# Altium project team build full layout.PrjPcb
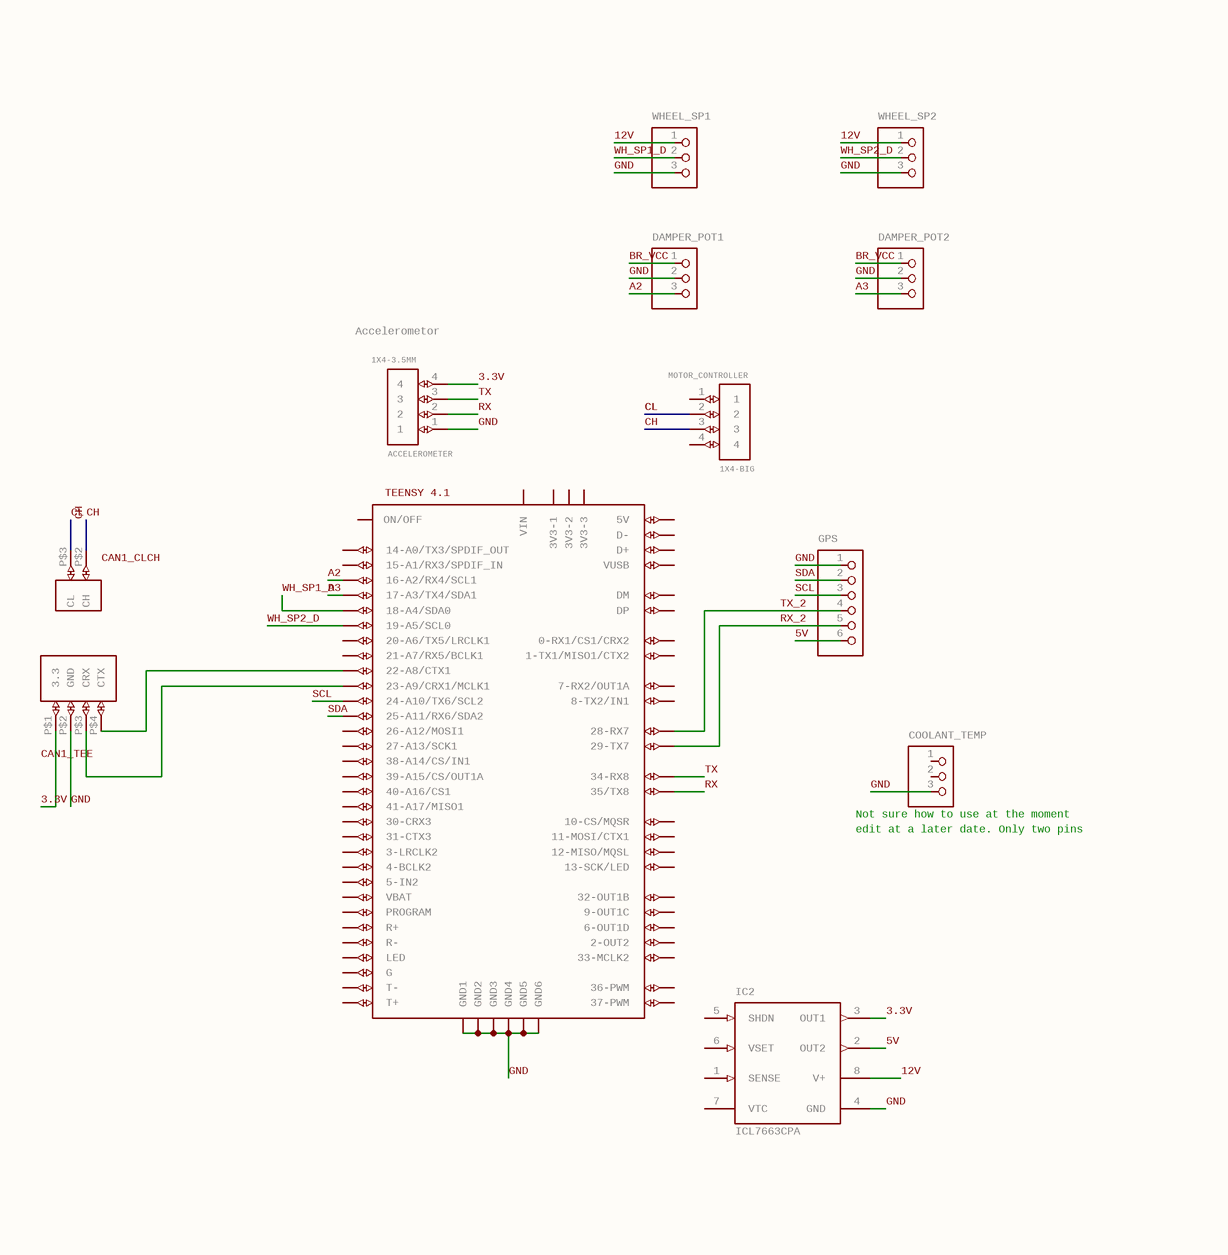
[diagram p0: team build full layout.SchDoc, left]
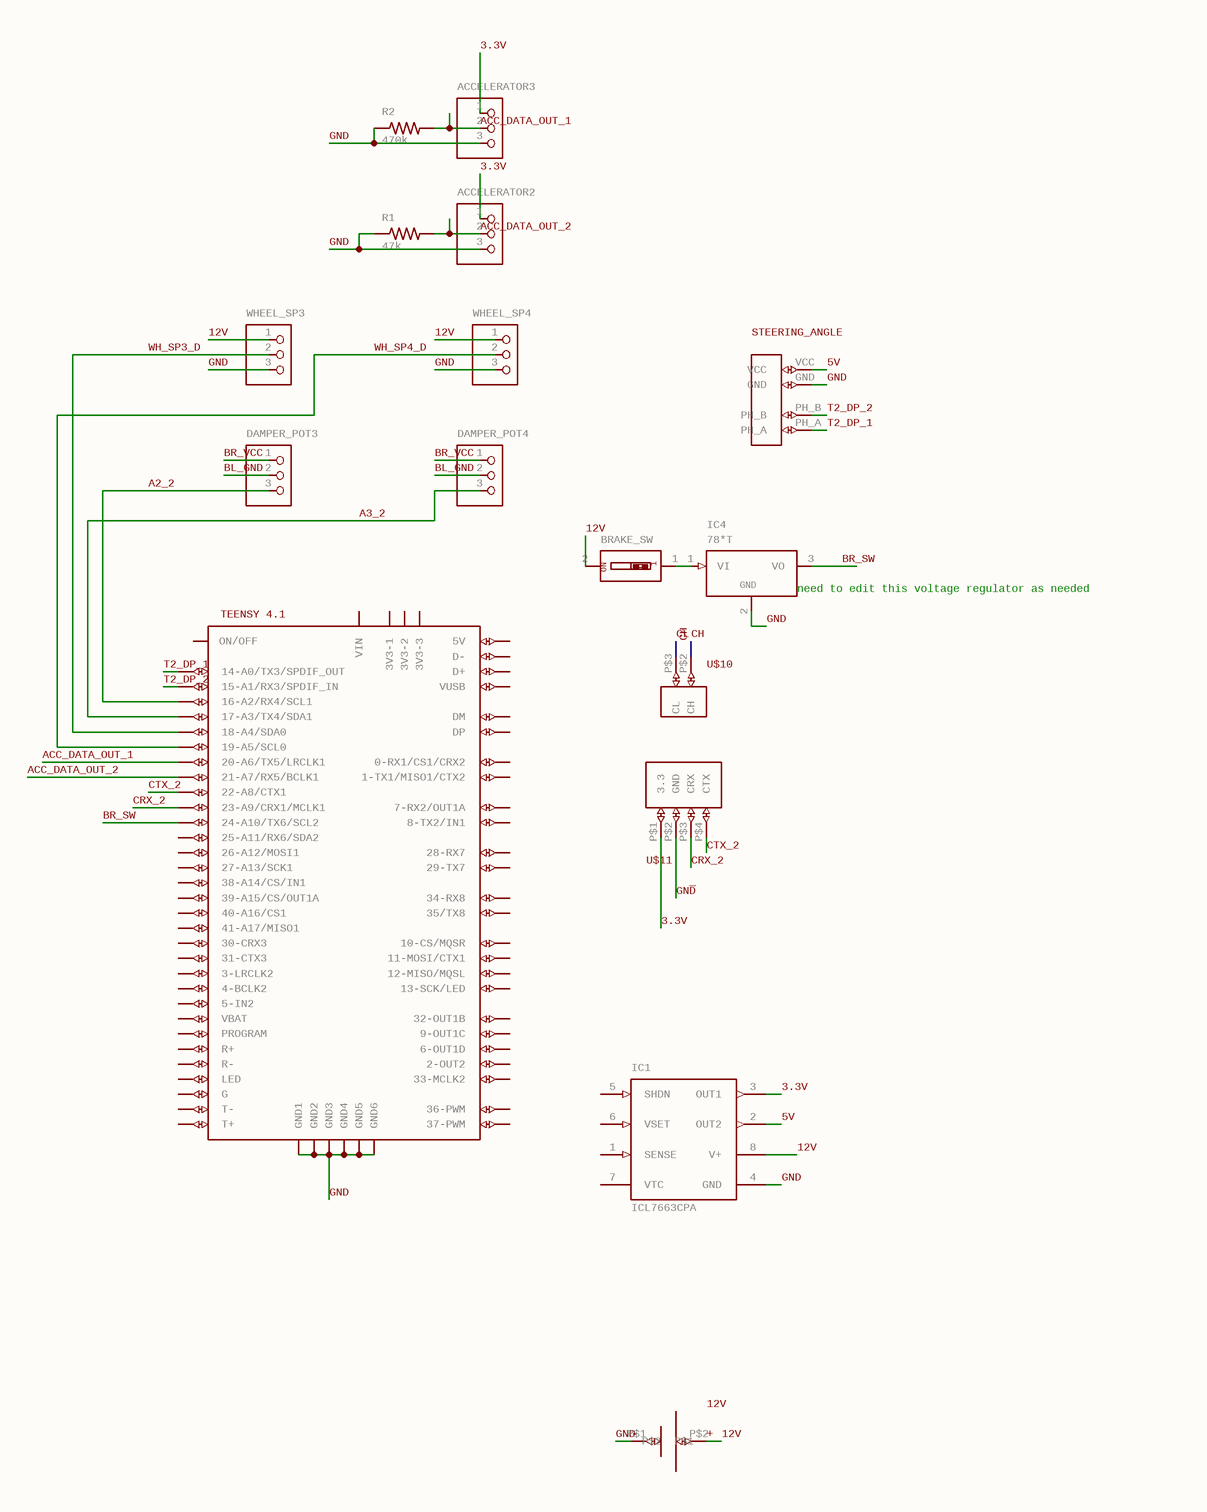
[diagram p1: team build full layout.SchDoc, middle]
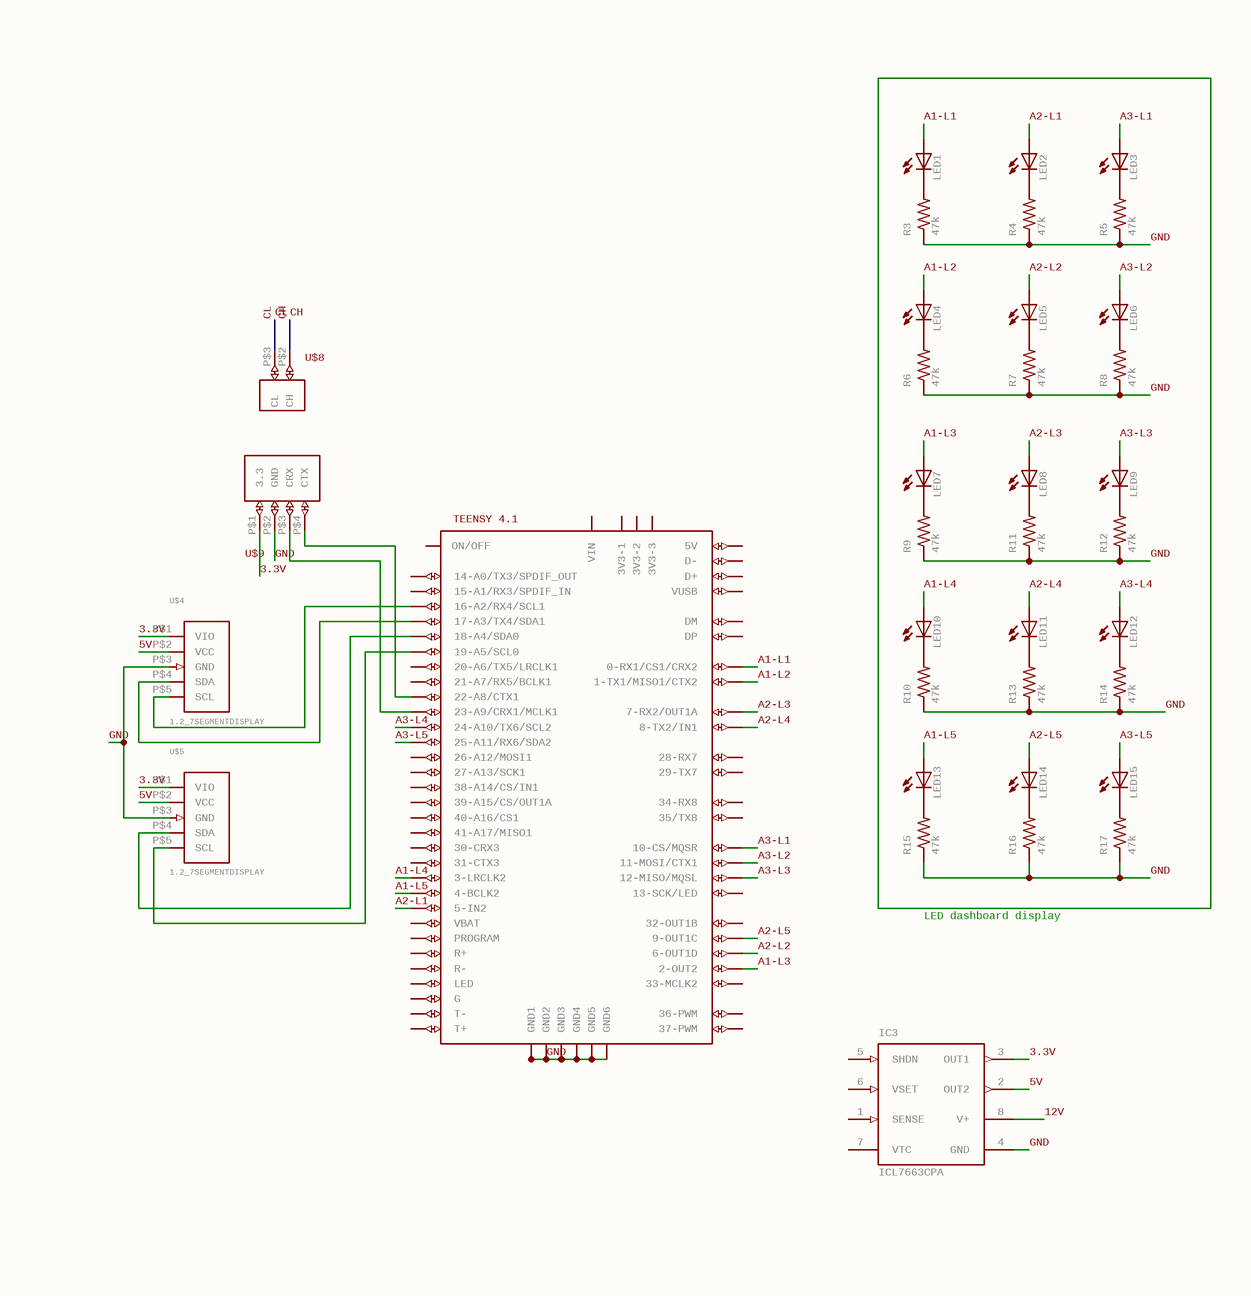
[diagram p2: team build full layout.SchDoc, right]
1 sheet, 64 parts. Net scope: global (net labels, ports and power ports of the same name join across sheets).

## Sheet team build full layout.SchDoc
size 739 x 259 mm; Origin: Eagle

### Parts
12V  PWD_12  [PWD_12]  (value not drawn)
ACCELERATOR2  PINHD-1X3  [1X03]  (value not drawn)
ACCELERATOR3  PINHD-1X3  [1X03]  (value not drawn)
ACCELEROMETER  1X4-3.5MM  AC: Accelerometor  [1X04-3.5MM]
BRAKE_SW  SW_DIP-1  [EDG-01]  (value not drawn)
CAN1_CLCH  CAN_BUS  [CAN_BUS]  (value not drawn)
CAN1_TEE  CAN_TEE  [CAN_TEN]  (value not drawn)
COOLANT_TEMP  PINHD-1X3  [1X03]  (value not drawn)
DAMPER_POT1  PINHD-1X3CB  [1X03-CLEANBIG]  (value not drawn)
DAMPER_POT2  PINHD-1X3CB  [1X03-CLEANBIG]  (value not drawn)
DAMPER_POT3  PINHD-1X3CB  [1X03-CLEANBIG]  (value not drawn)
DAMPER_POT4  PINHD-1X3CB  [1X03-CLEANBIG]  (value not drawn)
GPS  PINHD-1X6-3.5MM  [1X06-3.5MM]  (value not drawn)
IC1  ICL7663CPA  [DIL08]
IC2  ICL7663CPA  [DIL08]
IC3  ICL7663CPA  [DIL08]
IC4  78*T  [TO220H]
LED1  LED3MM  [LED3MM]  (value not drawn)
LED2  LED3MM  [LED3MM]  (value not drawn)
LED3  LED3MM  [LED3MM]  (value not drawn)
LED4  LED3MM  [LED3MM]  (value not drawn)
LED5  LED3MM  [LED3MM]  (value not drawn)
LED6  LED3MM  [LED3MM]  (value not drawn)
LED7  LED3MM  [LED3MM]  (value not drawn)
LED8  LED3MM  [LED3MM]  (value not drawn)
LED9  LED3MM  [LED3MM]  (value not drawn)
LED10  LED3MM  [LED3MM]  (value not drawn)
LED11  LED3MM  [LED3MM]  (value not drawn)
LED12  LED3MM  [LED3MM]  (value not drawn)
LED13  LED3MM  [LED3MM]  (value not drawn)
LED14  LED3MM  [LED3MM]  (value not drawn)
LED15  LED3MM  [LED3MM]  (value not drawn)
MOTOR_CONTROLLER  1X4-BIG  [1X04-BIG]
R1  47k  [0204/7]
R2  470k  [0204/7]
R3  47k  [0204/7]
R4  47k  [0204/7]
R5  47k  [0204/7]
R6  47k  [0204/7]
R7  47k  [0204/7]
R8  47k  [0204/7]
R9  47k  [0204/7]
R10  47k  [0204/7]
R11  47k  [0204/7]
R12  47k  [0204/7]
R13  47k  [0204/7]
R14  47k  [0204/7]
R15  47k  [0204/7]
R16  47k  [0204/7]
R17  47k  [0204/7]
STEERING_ANGLE  ROTARY_ENCODER  [ROTARY_ENCODER]  (value not drawn)
U$1  TEENSY4.1: TEENSY 4.1  [TEENSY41]  (hidden comment: TEENSY41)
U$2  TEENSY4.1: TEENSY 4.1  [TEENSY41]  (hidden comment: TEENSY41)
U$3  TEENSY4.1: TEENSY 4.1  [TEENSY41]  (hidden comment: TEENSY41)
U$4  1.2_7SEGMENTDISPLAY  [5IL]
U$5  1.2_7SEGMENTDISPLAY  [5IL]
U$8  CAN_BUS  [CAN_BUS]  (value not drawn)
U$9  CAN_TEE  [CAN_TEN]  (value not drawn)
U$10  CAN_BUS  [CAN_BUS]  (value not drawn)
U$11  CAN_TEE  [CAN_TEN]  (value not drawn)
WHEEL_SP1  PINHD-1X3  [1X03]  (value not drawn)
WHEEL_SP2  PINHD-1X3  [1X03]  (value not drawn)
WHEEL_SP3  PINHD-1X3  [1X03]  (value not drawn)
WHEEL_SP4  PINHD-1X3  [1X03]  (value not drawn)

### Nets
3.3V: ACCELERATOR2.1 ACCELERATOR3.1 ACCELEROMETER.4 CAN1_TEE.P$1(3.3) IC1.3(OUT1) IC2.3(OUT1) IC3.3(OUT1) U$4.P$1(VIO) U$5.P$1(VIO) U$9.P$1(3.3) U$11.P$1(3.3)
5V: GPS.6 IC1.2(OUT2) IC2.2(OUT2) IC3.2(OUT2) STEERING_ANGLE.VCC U$4.P$2(VCC) U$5.P$2(VCC)
12V: 12V.P$2 BRAKE_SW.2 IC1.8(V+) IC2.8(V+) IC3.8(V+) WHEEL_SP1.1 WHEEL_SP2.1 WHEEL_SP3.1 WHEEL_SP4.1
A1-L1: LED1.A U$2.0-RX1/CS1/CRX2
A1-L2: LED4.A U$2.1-TX1/MISO1/CTX2
A1-L3: LED7.A U$2.2-OUT2
A1-L4: LED10.A U$2.3-LRCLK2
A1-L5: LED13.A U$2.4-BCLK2
A2: DAMPER_POT1.3 U$1.16-A2/RX4/SCL1
A2-L1: LED2.A U$2.5-IN2
A2-L2: LED5.A U$2.6-OUT1D
A2-L3: LED8.A U$2.7-RX2/OUT1A
A2-L4: LED11.A U$2.8-TX2/IN2(8-TX2/IN1)
A2-L5: LED14.A U$2.9-OUT1C
A2_2: DAMPER_POT3.3 U$3.16-A2/RX4/SCL1
A3: DAMPER_POT2.3 U$1.17-A3/TX4/SDA1
A3-L1: LED3.A U$2.10-CS\MQSR(10-CS/MQSR)
A3-L2: LED6.A U$2.11-MOSI/CTX1
A3-L3: LED9.A U$2.12-MISO/MQSL
A3-L4: LED12.A U$2.24-A10/TX6/SCL2
A3-L5: LED15.A U$2.25-A11/RX6/SDA2
A3_2: DAMPER_POT4.3 U$3.17-A3/TX4/SDA1
ACC_DATA_OUT_1: ACCELERATOR3.2 R2.2 U$3.20-A6/TX5/LRCLK1
ACC_DATA_OUT_2: ACCELERATOR2.2 R1.2 U$3.21-A7/RX5/BCLK1
BL_GND: DAMPER_POT3.2 DAMPER_POT4.2
BR_SW: IC4.3(VO) U$3.24-A10/TX6/SCL2
BR_VCC: DAMPER_POT1.1 DAMPER_POT2.1 DAMPER_POT3.1 DAMPER_POT4.1
CRX_2: U$3.23-A9/CRX1/MCLK1 U$11.P$3(CRX)
CTX_2: U$3.22-A8/CTX1 U$11.P$4(CTX)
GND: 12V.P$1 ACCELERATOR2.3 ACCELERATOR3.3 ACCELEROMETER.1 CAN1_TEE.P$2(GND) COOLANT_TEMP.3 DAMPER_POT1.2 DAMPER_POT2.2 GPS.1 IC1.4(GND) IC2.4(GND) IC3.4(GND) IC4.2(GND) R1.1 R2.1 R3.1 R4.1 R5.1 R6.1 R7.1 R8.1 R9.1 R10.1 R11.1 R12.1 R13.1 R14.1 R15.1 R16.1 R17.1 STEERING_ANGLE.GND U$1.GND1 U$1.GND2 U$1.GND3 U$1.GND4 U$1.GND5 U$1.GND6 U$2.GND1 U$2.GND2 U$2.GND3 U$2.GND4 U$2.GND5 U$2.GND6 U$3.GND1 U$3.GND2 U$3.GND3 U$3.GND4 U$3.GND5 U$3.GND6 U$4.P$3(GND) U$5.P$3(GND) U$9.P$2(GND) WHEEL_SP1.3 WHEEL_SP2.3 WHEEL_SP3.3 WHEEL_SP4.3
GN~{D}: U$11.P$2(GND)
RX: ACCELEROMETER.2 U$1.35-TX8(35/TX8)
RX_2: GPS.5 U$1.29-TX7
SCL: GPS.3 U$1.24-A10/TX6/SCL2
SDA: GPS.2 U$1.25-A11/RX6/SDA2
T2_DP_1: STEERING_ANGLE.PH_A U$3.14-A0/TX3/SPDIF_OUT
T2_DP_2: STEERING_ANGLE.PH_B U$3.15-A1/RX3/SPDIF_IN
TX: ACCELEROMETER.3 U$1.34-RX8
TX_2: GPS.4 U$1.28-RX7
WH_SP1_D: U$1.18-A4/SDA0 WHEEL_SP1.2
WH_SP2_D: U$1.19-A5/SCL0 WHEEL_SP2.2
WH_SP3_D: U$3.18-A4/SDA0 WHEEL_SP3.2
WH_SP4_D: U$3.19-A5/SCL0 WHEEL_SP4.2
NetBRAKE_SW_1: BRAKE_SW.1 IC4.1(VI)
NetCAN1_TEE_P$3: CAN1_TEE.P$3(CRX) U$1.23-A9/CRX1/MCLK1
NetCAN1_TEE_P$4: CAN1_TEE.P$4(CTX) U$1.22-A8/CTX1
NetLED1_K: LED1.K(C) R3.2
NetLED2_K: LED2.K(C) R4.2
NetLED3_K: LED3.K(C) R5.2
NetLED4_K: LED4.K(C) R6.2
NetLED5_K: LED5.K(C) R7.2
NetLED6_K: LED6.K(C) R8.2
NetLED7_K: LED7.K(C) R9.2
NetLED8_K: LED8.K(C) R11.2
NetLED9_K: LED9.K(C) R12.2
NetLED10_K: LED10.K(C) R10.2
NetLED11_K: LED11.K(C) R13.2
NetLED12_K: LED12.K(C) R14.2
NetLED13_K: LED13.K(C) R15.2
NetLED14_K: LED14.K(C) R16.2
NetLED15_K: LED15.K(C) R17.2
NetU$2_16-A2/RX4/SCL1: U$2.16-A2/RX4/SCL1 U$4.P$5(SCL)
NetU$2_17-A3/TX4/SDA1: U$2.17-A3/TX4/SDA1 U$4.P$4(SDA)
NetU$2_18-A4/SDA0: U$2.18-A4/SDA0 U$5.P$4(SDA)
NetU$2_19-A5/SCL0: U$2.19-A5/SCL0 U$5.P$5(SCL)
NetU$2_22-A8/CTX1: U$2.22-A8/CTX1 U$9.P$4(CTX)
NetU$2_23-A9/CRX1/MCLK1: U$2.23-A9/CRX1/MCLK1 U$9.P$3(CRX)

Not connected (* = marked no-connect by the designer): CAN1_CLCH P$2(CH) P$3(CL); COOLANT_TEMP 1 2; IC1 1(SENSE) 5(SHDN) 6(VSET) 7(VTC); IC2 1(SENSE) 5(SHDN) 6(VSET) 7(VTC); IC3 1(SENSE) 5(SHDN) 6(VSET) 7(VTC); MOTOR_CONTROLLER 1 2 3 4; U$1 0-RX1/CS1/CRX2 1-TX1/MISO1/CTX2 2-OUT2 3-LRCLK2 3V3-1 3V3-2 3V3-3 4-BCLK2 5-IN2 6-OUT1D 7-RX2/OUT1A 8-TX2/IN2(8-TX2/IN1) 9-OUT1C 10-CS\MQSR(10-CS/MQSR) 11-MOSI/CTX1 12-MISO/MQSL 13-SCK/LED 14-A0/TX3/SPDIF_OUT 15-A1/RX3/SPDIF_IN 20-A6/TX5/LRCLK1 21-A7/RX5/BCLK1 26-A12/MOSI1 27-A13/SCK1 30-CRX3 31-CTX3 32-OUT1B 33-MCLK2 36-PWM 37-PWM 38-A14/CS/IN1 39-A15/CS/OUT1A 40-A16/CS1 41-A17/MISO1 +5V(5V) D+ D- DM DP G LED ON/OFF PROGRAM R+ R- T+ T- VBAT VIN VUSB; U$2 3V3-1 3V3-2 3V3-3 13-SCK/LED 14-A0/TX3/SPDIF_OUT 15-A1/RX3/SPDIF_IN 20-A6/TX5/LRCLK1 21-A7/RX5/BCLK1 26-A12/MOSI1 27-A13/SCK1 28-RX7 29-TX7 30-CRX3 31-CTX3 32-OUT1B 33-MCLK2 34-RX8 35-TX8(35/TX8) 36-PWM 37-PWM 38-A14/CS/IN1 39-A15/CS/OUT1A 40-A16/CS1 41-A17/MISO1 +5V(5V) D+ D- DM DP G LED ON/OFF PROGRAM R+ R- T+ T- VBAT VIN VUSB; U$3 0-RX1/CS1/CRX2 1-TX1/MISO1/CTX2 2-OUT2 3-LRCLK2 3V3-1 3V3-2 3V3-3 4-BCLK2 5-IN2 6-OUT1D 7-RX2/OUT1A 8-TX2/IN2(8-TX2/IN1) 9-OUT1C 10-CS\MQSR(10-CS/MQSR) 11-MOSI/CTX1 12-MISO/MQSL 13-SCK/LED 25-A11/RX6/SDA2 26-A12/MOSI1 27-A13/SCK1 28-RX7 29-TX7 30-CRX3 31-CTX3 32-OUT1B 33-MCLK2 34-RX8 35-TX8(35/TX8) 36-PWM 37-PWM 38-A14/CS/IN1 39-A15/CS/OUT1A 40-A16/CS1 41-A17/MISO1 +5V(5V) D+ D- DM DP G LED ON/OFF PROGRAM R+ R- T+ T- VBAT VIN VUSB; U$8 P$2(CH) P$3(CL); U$10 P$2(CH) P$3(CL)

### Buses and harness runs
bus CH
bus CL

### Notes on the sheet
- (near IC4) need to edit this voltage regulator as needed
- (near COOLANT_TEMP) Not sure how to use at the moment
- (near COOLANT_TEMP) edit at a later date. Only two pins
- LED dashboard display

### Library data of the parts
12V = PWD_12: GateName_1: G$1; SymbolName_1: PWD_12; LibraryName: F-E library custom components; DeviceSetName: PWD_12; +: +; -: -
ACCELERATOR2 ACCELERATOR3 COOLANT_TEMP WHEEL_SP1-WHEEL_SP4 = PINHD-1X3: PIN HEADER; GateName_1: A; SymbolName_1: PINHD3; LibraryName: adafruit; DeviceSetName: PINHD-1X3
ACCELEROMETER = 1X4-3.5MM: 4-pin connector; GateName_1: G$1; SymbolName_1: 1X4; DeviceName: -3.5MM; LibraryName: adafruit; DeviceSetName: 1X4
BRAKE_SW = SW_DIP-1: DIP SWITCH; GateName_1: G$1; POPULARITY: 3; SymbolName_1: SW_DIP-1; LibraryName: special; DeviceSetName: SW_DIP-1; 1: 1; ON: ON
CAN1_CLCH U$8 U$10 = CAN_BUS: GateName_1: G$1; SymbolName_1: CAN_BUS; LibraryName: F-E library custom components; DeviceSetName: CAN_BUS
CAN1_TEE U$9 U$11 = CAN_TEE: GateName_1: G$1; SymbolName_1: CAN_TEN; LibraryName: F-E library custom components; DeviceSetName: CAN_TEE
DAMPER_POT1-DAMPER_POT4 = PINHD-1X3CB: PIN HEADER; GateName_1: A; SymbolName_1: PINHD3; DeviceName: CB; LibraryName: adafruit; DeviceSetName: PINHD-1X3
GPS = PINHD-1X6-3.5MM: PIN HEADER; GateName_1: A; SymbolName_1: PINHD6; DeviceName: -3.5MM; LibraryName: adafruit; DeviceSetName: PINHD-1X6
IC1-IC3 = ICL7663CPA: Positive VOLTAGE REGULATOR; GateName_1: G$1; POPULARITY: 0; SymbolName_1: ICL7663; LibraryName: maxim; DeviceSetName: ICL7663CPA; MF: MF; MPN: MPN; OC_FARNELL: unknown; OC_NEWARK: unknown
IC4 = 78*T: Positive VOLTAGE REGULATOR   Added bigger pads to the TO-92 package; GateName_1: A1; SymbolName_1: 78XX; DeviceName: T; DeviceSetName: 78*; LibraryName: adafruit; GND: GND
LED1-LED15 = LED3MM: LED   OSRAM: - CHIPLED LG R971, LG N971, LY N971, LG Q971, LY Q971, LO R971, LY R971 LH N974, LH R974 LS Q976, LO Q976, LY Q976 LO Q996 - Hyper CHIPLED LW Q18S LB Q993, LB Q99A, LB R99A - SideLED LS A670, LO A670, LY A670, LG A670, LP A670 LB A673, LV A673, LT A673, LW A673 LH A674 LY A675 LS A676, LA A676, LO A676, LY A676, LW A676 LS A679, LY A679, LG A679 -  Hyper Micro SIDELEDÂ® LS Y876, LA Y876, LO Y876, LY Y876 LT Y87S - SmartLED LW L88C, LW L88S LB L89C, LB L89S, LG L890 LS L89K, LO L89K, LY L89K LS L896, LA L896, LO L896, LY L896 - TOPLED LS T670, LO T670, LY T670, LG T670, LP T670 LSG T670, LSP T670, LSY T670, LOP T670, LYG T670 LG T671, LOG T671, LSG T671 LB T673, LV T673, LT T673, LW T673 LH T674 LS T676, LA T676, LO T676, LY T676, LB T676, LH T676, LSB T676, LW T676 LB T67C, LV T67C, LT T67C, LS T67K, LO T67K, LY T67K, LW E67C LS E67B, LA E67B, LO E67B, LY E67B, LB E67C, LV E67C, LT E67C LW T67C LS T679, LY T679, LG T679 LS T770, LO T770, LY T770, LG T770, LP T770 LB T773, LV T773, LT T773, LW T773 LH T774 LS E675, LA E675, LY E675, LS T675 LS T776, LA T776, LO T776, LY T776, LB T776 LHGB T686 LT T68C, LB T68C - Hyper Mini TOPLEDÂ® LB M676 - Mini TOPLED SantanaÂ® LG M470 LS M47K, LO M47K, LY M47K    Source: http://www.osram.convergy.de/; GateName_1: G$1; DeviceName: 3MM; SymbolName_1: LED; LibraryName: adafruit; DeviceSetName: LED
MOTOR_CONTROLLER = 1X4-BIG: 4-pin connector; GateName_1: G$1; SymbolName_1: 1X4; DeviceName: -BIG; LibraryName: adafruit; DeviceSetName: 1X4
R1-R17 = R-US_0204/7: RESISTOR, American symbol; GateName_1: G$1; SymbolName_1: R-US; DeviceSetName: R-US_; POPULARITY: 48; DeviceName: 0204/7; LibraryName: rcl; SPICEPREFIX: R
STEERING_ANGLE = ROTARY_ENCODER: GateName_1: G$1; SymbolName_1: ROTARY_ENCODER; LibraryName: F-E library custom components; DeviceSetName: ROTARY_ENCODER
U$1-U$3 = TEENSY41: GateName_1: G$1; SymbolName_1: TEENSY41; LibraryName: teensy; DeviceSetName: TEENSY41
U$4 U$5 = 1.2_7SEGMENTDISPLAY: GateName_1: G$1; SymbolName_1: 1.2_7SEGMENTDISPLAY; LibraryName: David_Pinlayouts; DeviceSetName: 1.2_7SEGMENTDISPLAY